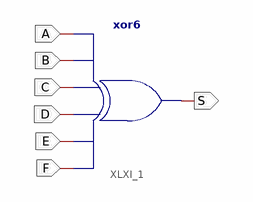
[diagram p0: schematic sheet 1]
// Xilinx ISE schematic xor5Sc.sch (artix7) as structural Verilog: 1 symbols, 7 ports
module xor5Sc (
  input  A,
  input  B,
  input  C,
  input  D,
  input  E,
  input  F,
  output S
);

  xor XLXI_1 (S, F, E, D, C, B, A);
endmodule
